# EAGLE design mother_card_10 (EAGLE 8.3.2)
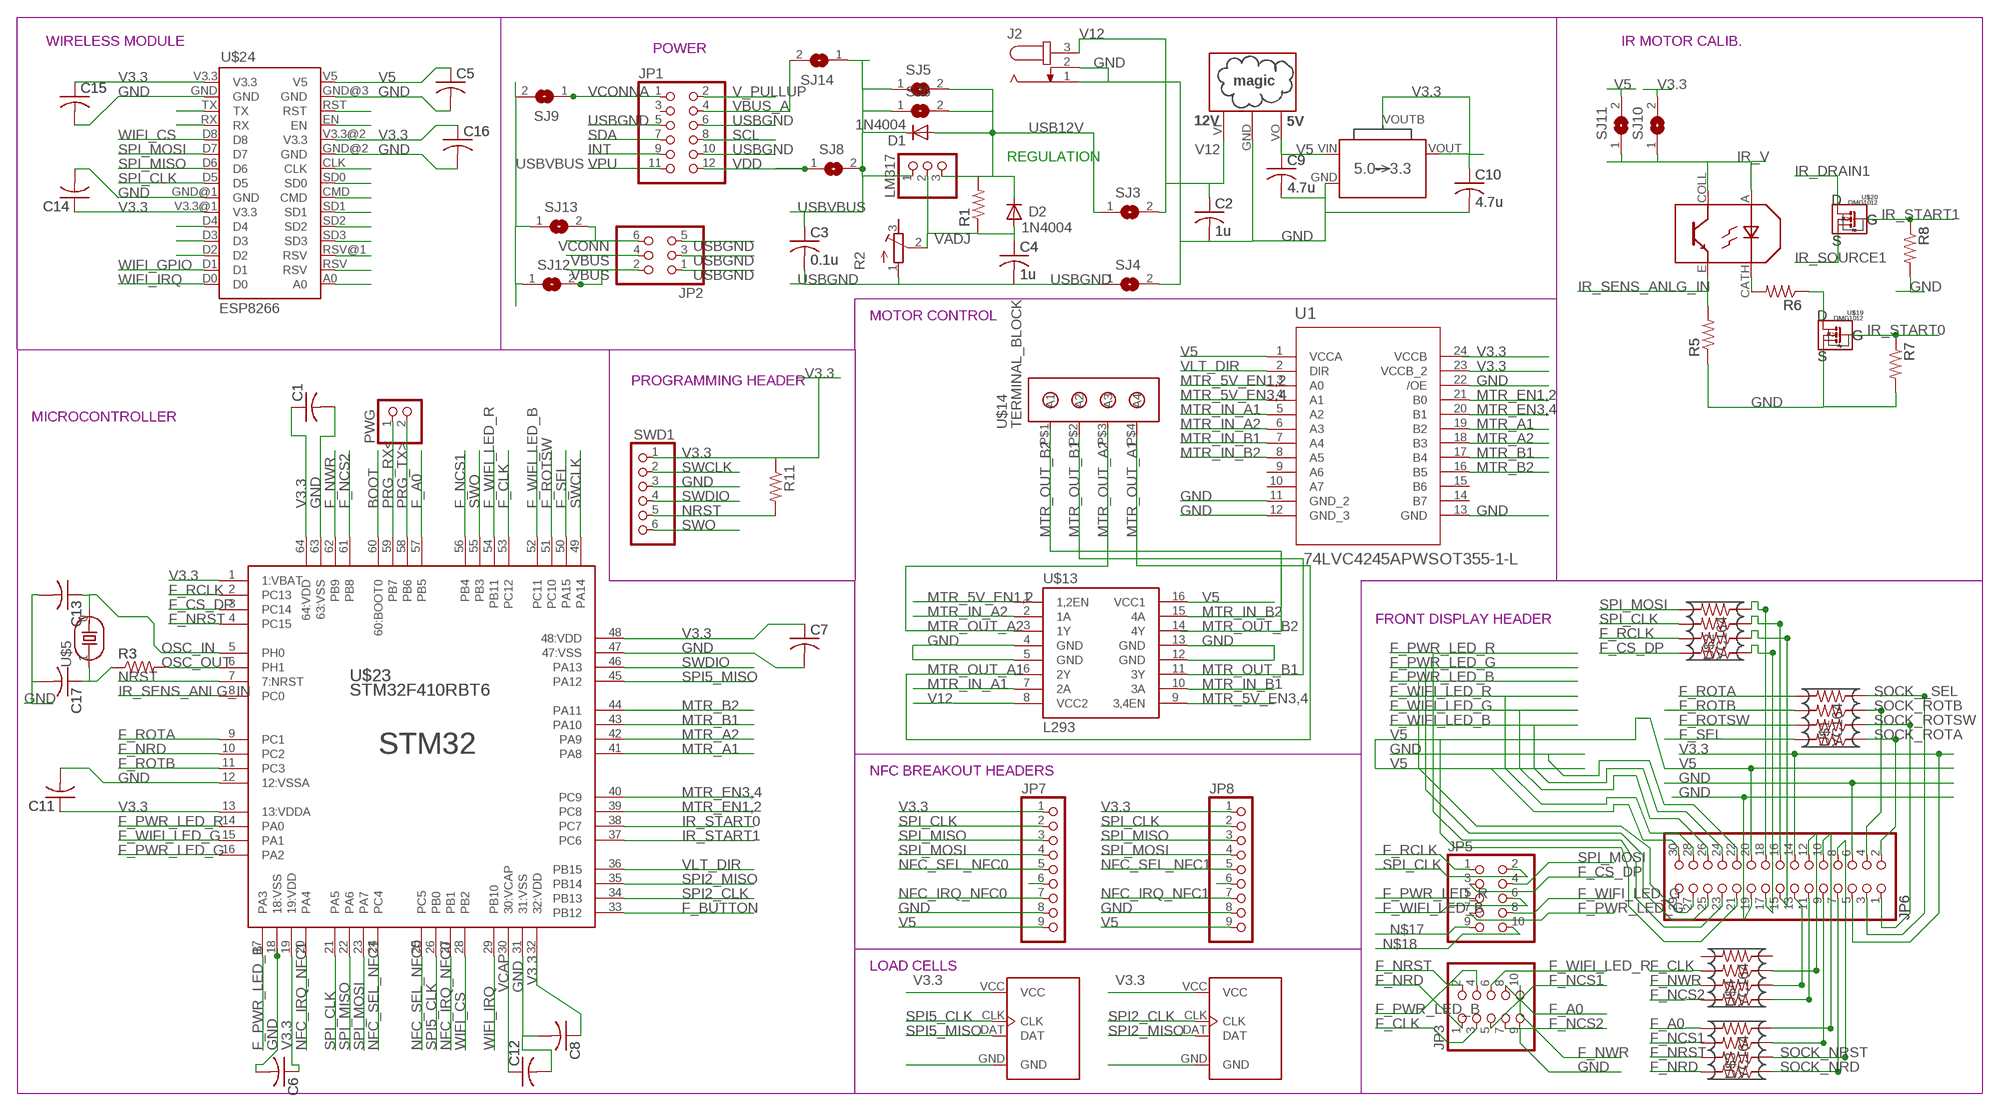
[diagram p0: schematic, sheet 1]

## Parts
C1  C-USC0805  [C0805]
C2  1u  C-USC0805  [C0805]
C3  0.1u  C-USC0805  [C0805]
C4  1u  C-USC0805  [C0805]
C5  C-USC0805  [C0805]
C6  C-USC0805  [C0805]
C7  C-USC0805  [C0805]
C8  C-USC0805  [C0805]
C9  4.7u  C-USC0805  [C0805]
C10  4.7u  C-USC0805  [C0805]
C11  C-USC0805  [C0805]
C12  C-USC0805  [C0805]
C13  C-USC0603  [C0603]
C14  C-USC0805  [C0805]
C15  C-USC0805  [C0805]
C16  C-USC0805  [C0805]
C17  C-USC0603  [C0603]
D1  1N4004  [DO41-10]
D2  1N4004  [DO41-10]
J2  JACK-PLUG0  [SPC4077]
JP1  PINHD-2X6  [2X06]
JP2  PINHD-2X3  [2X03]
JP3  PINHD-2X5  [2X05]
JP5  PINHD-2X5  [2X05]
JP6  PINHD-2X15/SOCK  [2X15/SOCK]
JP7  PINHD-1X9/90  [1X09/90]
JP8  PINHD-1X9/90  [1X09/90]
LM317  PINHD-1X3  [1X03]
PWG  PINHD-1X2  [1X02]
R1  R-US_R0805  [R0805]
R2  R-TRIMM64W  [RTRIM64W]
R3  R-US_R0805  [R0805]
R5  R-US_R0805  [R0805]
R6  R-US_R0805  [R0805]
R7  R-US_R0805  [R0805]
R8  R-US_R0805  [R0805]
R11  R-US_R0805  [R0805]
SJ3  SJ  [SJ]
SJ4  SJ  [SJ]
SJ5  SJ  [SJ]
SJ6  SJ  [SJ]
SJ8  SJ  [SJ]
SJ9  SJ  [SJ]
SJ10  SJ  [SJ]
SJ11  SJ  [SJ]
SJ12  SJ  [SJ]
SJ13  SJ  [SJ]
SJ14  SJ  [SJ]
SWD1  PINHD-1X6  [1X06]
U1  74LVC4245APWSOT355-1-L  [SOT355-1-L]
U$1  YC164  [YC164]
U$2  YC164  [YC164]
U$3  YC164  [YC164]
U$4  YC164  [YC164]
U$5  HC-49S_9B  [HC-49S_9B]
U$13  L293  [DIL16]
U$14  TERMINAL_BLOCK  [1X4/BLOCK]
U$15  AP2114H  [AP2114H]
U$16  OKI-78SR-W36  [SIP3]
U$18  TCRT5000  [TCRT5000]
U$19  DMG1012  [SOT323]
U$20  DMG1012  [SOT323]
U$21  HX711  [HX711]
U$22  HX711  [HX711]
U$23  STM32F410RBT6  [QFP50P1200X1200X160-64N]
U$24  ESP8266  [ESP8266]

## Nets
BOOT: U$23.60(60:BOOT0)
F_A0: JP3.8 U$3.P$4 U$23.57(PB5)
F_BUTTON: U$23.33(PB12)
F_CLK: JP3.3 U$4.P$3 U$23.53(PC12)
F_CS_DP: JP5.3 U$2.P$1 U$23.3(PC14)
F_NCS1: JP3.5 U$3.P$3 U$23.56(PB4)
F_NCS2: JP3.7 U$23.61(PB8)
F_NRD: JP3.1 U$3.P$1 U$23.10(PC2)
F_NRST: JP3.2 U$3.P$2 U$23.4(PC15)
F_NWR: JP3.10 U$4.P$2 U$23.62(PB9)
F_PWR_LED_B: JP3.4 JP6.27 U$23.17(PA3)
F_PWR_LED_G: JP5.7 JP6.25 U$23.16(PA2)
F_PWR_LED_R: JP5.5 JP6.23 U$23.14(PA0)
F_RCLK: JP5.1 U$2.P$2 U$23.2(PC13)
F_ROTA: U$1.P$4 U$23.9(PC1)
F_ROTB: U$1.P$3 U$23.11(PC3)
F_ROTSW: U$1.P$2 U$23.51(PC10)
F_SEL: U$1.P$1 U$23.50(PA15)
F_WIFI_LED_B: JP5.6 JP6.24 U$23.52(PC11)
F_WIFI_LED_G: JP5.8 JP6.26 U$23.15(PA1)
F_WIFI_LED_R: JP3.6 JP6.28 U$23.54(PB11)
GND: C1.2 C2.2 C5.2 C6.2 C7.2 C8.2 C9.2 C10.2 C11.2 C12.2 C13.2 C14.2 C15.2 C16.2 C17.2 J2.1 J2.2 JP3.9 JP6.6 JP6.19 JP6.22 JP7.8 JP8.8 R5.1 R7.2 R8.2 SJ4.2 SWD1.3 U1.11(GND_2) U1.12(GND_3) U1.13(GND) U1.22(/OE) U$13.4(GND) U$13.5(GND) U$13.12(GND) U$13.13(GND) U$15.GND U$16.GND U$19.S U$21.GND U$22.GND U$23.12(12:VSSA) U$23.18(18:VSS) U$23.31(31:VSS) U$23.47(47:VSS) U$23.63(63:VSS) U$24.GND U$24.GND@1(GND) U$24.GND@2(GND) U$24.GND@3(GND)
INT: JP1.9
IR_DRAIN1: U$20.D
IR_SENS_ANLG_IN: R5.2 U$18.E U$23.8(PC0)
IR_SOURCE1: U$20.S
IR_START0: R7.1 U$19.G U$23.38(PC7)
IR_START1: R8.1 U$20.G U$23.37(PC6)
IR_V: SJ10.1 SJ11.1 U$18.A U$18.COLL
MTR_5V_EN1,2: U1.3(A0) U$13.1(1,2EN)
MTR_5V_EN3,4: U1.4(A1) U$13.9(3,4EN)
MTR_A1: U1.19(B2) U$23.41(PA8)
MTR_A2: U1.18(B3) U$23.42(PA9)
MTR_B1: U1.17(B4) U$23.43(PA10)
MTR_B2: U1.16(B5) U$23.44(PA11)
MTR_EN1,2: U1.21(B0) U$23.39(PC8)
MTR_EN3,4: U1.20(B1) U$23.40(PC9)
MTR_IN_A1: U1.5(A2) U$13.7(2A)
MTR_IN_A2: U1.6(A3) U$13.2(1A)
MTR_IN_B1: U1.7(A4) U$13.10(3A)
MTR_IN_B2: U1.8(A5) U$13.15(4A)
MTR_OUT_A1: U$13.6(2Y) U$14.P$4(A4)
MTR_OUT_A2: U$13.3(1Y) U$14.P$3(A3)
MTR_OUT_B1: U$13.11(3Y) U$14.P$2(A2)
MTR_OUT_B2: U$13.14(4Y) U$14.P$1(A1)
N$1: U$24.A0
N$2: JP7.6
N$4: JP8.6
N$5: R6.2 U$18.CATH
N$8: R3.2 U$23.6(PH1)
N$9: U$24.RSV
N$10: R6.1 U$19.D
N$13: U$24.RSV@1(RSV)
N$14: U$24.SD3
N$15: U$24.SD2
N$16: U$24.SD1
N$17: JP5.9
N$18: JP5.10
N$23: U$24.CMD
N$24: U$24.SD0
N$25: U$24.CLK
N$26: U$24.D2
N$27: U$24.D3
N$28: U$24.D4
N$29: U$24.RX
N$30: U$24.TX
N$31: U$24.EN
N$32: U$24.RST
N$33: U$4.P$1
NFC_IRQ_NFC0: JP7.7 U$23.27(PB1)
NFC_IRQ_NFC1: JP8.7 U$23.20(PA4)
NFC_SEL_NFC0: JP7.5 U$23.25(PC5)
NFC_SEL_NFC1: JP8.5 U$23.24(PC4)
NRST: R11.2 SWD1.5 U$23.7(7:NRST)
OSC_IN: C13.1 U$5.0 U$23.5(PH0)
OSC_OUT: C17.1 R3.1 U$5.1
PRG_RX<: PWG.1 U$23.59(PB7)
PRG_TX>: PWG.2 U$23.58(PB6)
SCL: JP1.8
SDA: JP1.7
SOCK__CS_DP: JP6.17 U$2.P$11
SOCK__RCLK: JP6.15 U$2.P$22
SOCK__SEL: JP6.3 U$1.P$44
SOCK_A0: JP6.10 U$3.P$44
SOCK_CLK: JP6.12 U$4.P$33
SOCK_NCS1: JP6.9 U$3.P$33
SOCK_NCS2: JP6.11 U$4.P$11
SOCK_NRD: JP6.7 U$3.P$11
SOCK_NRST: JP6.8 U$3.P$22
SOCK_NWR: JP6.13 U$4.P$22
SOCK_ROTA: JP6.2 U$1.P$11
SOCK_ROTB: JP6.4 U$1.P$33
SOCK_ROTSW: JP6.1 U$1.P$22
SOCK_SPI_CLK: JP6.16 U$2.P$33
SOCK_SPI_MOSI: JP6.18 U$2.P$44
SPI2_CLK: U$22.CLK U$23.34(PB13)
SPI2_MISO: U$22.DAT U$23.35(PB14)
SPI5_CLK: U$21.CLK U$23.26(PB0)
SPI5_MISO: U$21.DAT U$23.45(PA12)
SPI_CLK: JP5.2 JP7.2 JP8.2 U$2.P$3 U$23.21(PA5) U$24.D5
SPI_MISO: JP7.3 JP8.3 U$23.22(PA6) U$24.D6
SPI_MOSI: JP5.4 JP7.4 JP8.4 U$2.P$4 U$23.23(PA7) U$24.D7
SWCLK: SWD1.2 U$23.49(PA14)
SWDIO: SWD1.4 U$23.46(PA13)
SWO: SWD1.6 U$23.55(PB3)
USB12V: D1.A D2.C LM317.3 R1.2 SJ3.1 SJ5.2 SJ6.2
USBGND: C3.2 C4.2 JP1.5 JP1.6 JP1.10 JP2.1 JP2.3 JP2.5 R2.1(A) SJ4.1
USBVBUS: C3.1 D1.C LM317.1 SJ5.1 SJ6.1 SJ8.2 SJ9.2 SJ12.1 SJ13.1 SJ14.1
V3.3: C1.1 C6.1 C7.1 C8.1 C10.1 C11.1 C14.1 C15.1 C16.1 JP6.5 JP6.14 JP7.1 JP8.1 R11.1 SJ10.2 SWD1.1 U1.23(VCCB_2) U1.24(VCCB) U$15.VOUT(VO) U$15.VOUTB(BODY) U$21.VCC U$22.VCC U$23.1(1:VBAT) U$23.13(13:VDDA) U$23.19(19:VDD) U$23.32(32:VDD) U$23.48(48:VDD) U$23.64(64:VDD) U$24.V3.3 U$24.V3.3@1(V3.3) U$24.V3.3@2(V3.3)
V5: C5.1 C9.1 JP6.20 JP6.21 JP6.30 JP7.9 JP8.9 SJ11.2 U1.1(VCCA) U$13.16(VCC1) U$15.VIN(VI) U$16.VO U$24.V5
V12: C2.1 J2.3 SJ3.2 U$13.8(VCC2) U$16.VI
V_PULLUP: JP1.2
VADJ: C4.1 D2.A LM317.2 R1.1 R2.2(S)
VBUS: JP2.2 JP2.4 SJ12.2
VBUS_A: JP1.4 SJ14.2
VCAP: C12.1 U$23.30(30:VCAP)
VCONN: JP2.6 SJ13.2
VCONNA: JP1.1 SJ9.1
VDD: JP1.12 SJ8.1
VLT_DIR: U1.2(DIR) U$23.36(PB15)
VPU: JP1.11
WIFI_CS: U$23.28(PB2) U$24.D8
WIFI_GPIO: U$24.D1
WIFI_IRQ: U$23.29(PB10) U$24.D0
Unconnected: JP1.3 JP6.29 R2.3(E) U1.9(A6) U1.10(A7) U1.14(B7) U1.15(B6) U$4.P$4 U$4.P$44

## Notes on the sheet
- WIRELESS MODULE | IR MOTOR CALIB.
- POWER
- REGULATION
- MOTOR CONTROL
- PROGRAMMING HEADER
- MICROCONTROLLER
- FRONT DISPLAY HEADER
- NFC BREAKOUT HEADERS
- LOAD CELLS

## Library data of the parts
C1-C17 = seniorDesign:C-US: CAPACITOR, American symbol
D1 D2 = diode:1N4004: DIODE general purpose rectifier, 1 A
J2 = con-jack:JACK-PLUG: DC POWER JACK Power Jack, DC, Right Angle, Through Hole, Rated 5A at 16VDC, PC Terminals Distributor: Farnell (www.Farnell.de) Drawing: 84N1161.pdf / 84N1162.pdf Manufacturer: SPC Technology (www.spctechnology.com) Type: SPC4077 / SPC 4078; OC_FARNELL: unknown; OC_NEWARK: unknown
JP1 = pinhead:PINHD-2X6: PIN HEADER
JP2 = pinhead:PINHD-2X3: PIN HEADER
JP3 JP5 = pinhead:PINHD-2X5: PIN HEADER
JP6 = seniorDesign:PINHD-2X15: PIN HEADER, socket for parallel cable, IDC connector, On Shore Technology Inc.
JP7 JP8 = pinhead:PINHD-1X9: PIN HEADER
LM317 = pinhead:PINHD-1X3: PIN HEADER
PWG = pinhead:PINHD-1X2: PIN HEADER
R1 R3 R5-R8 = seniorDesign:R-US_: RESISTOR, American symbol
R2 = rcl:R-TRIMM: Trimm resistor
R11 = resistor:R-US_: RESISTOR, American symbol
SJ3-SJ6 SJ8-SJ14 = jumper:SJ: SMD solder JUMPER
SWD1 = pinhead:PINHD-1X6: PIN HEADER
U1 = seniorDesign:74LVC4245APW: Level Translator input board; MANUFACTURER_PART_NUMBER: 74LVC4245APW; VENDOR: NXP
U$1-U$4 = seniorDesign:YC164: Yageo Resistor Array motherboard serial resistance for cables headed offboard
U$5 = seniorDesign:HC-49S_9B: TXC CORPORATION 9B-25.000MBBK-B motherboard stm32 HSE external clock reference http://www.txccorp.com/download/products/quartz_crystals/2015TXC_9B_33.pdf
U$13 = seniorDesign:L293: L293 Stepper Motor Driver
U$14 = seniorDesign:TERMINAL_BLOCK: Terminal Block for stepper motor connections
U$15 = seniorDesign:AP2114: AP2114H-3.3TRG1DICT-ND 5V LDO, main 5V line, motherboard https://www.diodes.com/assets/Datasheets/AP2114.pdf
U$16 = seniorDesign:OKI-78SR-W36
U$18 = seniorDesign:TCRT5000: Vishay Semiconductor Opto Division TCRT5000 mother board cover repositioning http://www.vishay.com/docs/83760/tcrt5000.pdf
U$19 U$20 = seniorDesign:DMG1012: DMG1012UW-7DICT-ND https://www.diodes.com/assets/Datasheets/ds31859.pdf Vt ~= 1.25V, IDS ~= 0.900 A, [VGS = (3.3 - 0.7)V, VDS = 0V]
U$21 U$22 = seniorDesign:HX711: old green circuit board rendition of HX711 load amplifier
U$23 = seniorDesign:STM32F410RBT6: STMicroelectronics STM32F410RBT6 main microcontroller, motherboard http://www.st.com/.../content/translations/en.DM00214043.pdf <http://www.st.com/content/ccc/resource/technical/document/datasheet/6e/f3/b0/1b/05/eb/49/fe/DM00214043.pdf/files/DM00214043.pdf/jcr:content/translations/en.DM00214043.pdf>
U$24 = seniorDesign:ESP8266: ESP8266 Wifi Module Breakout

## Board
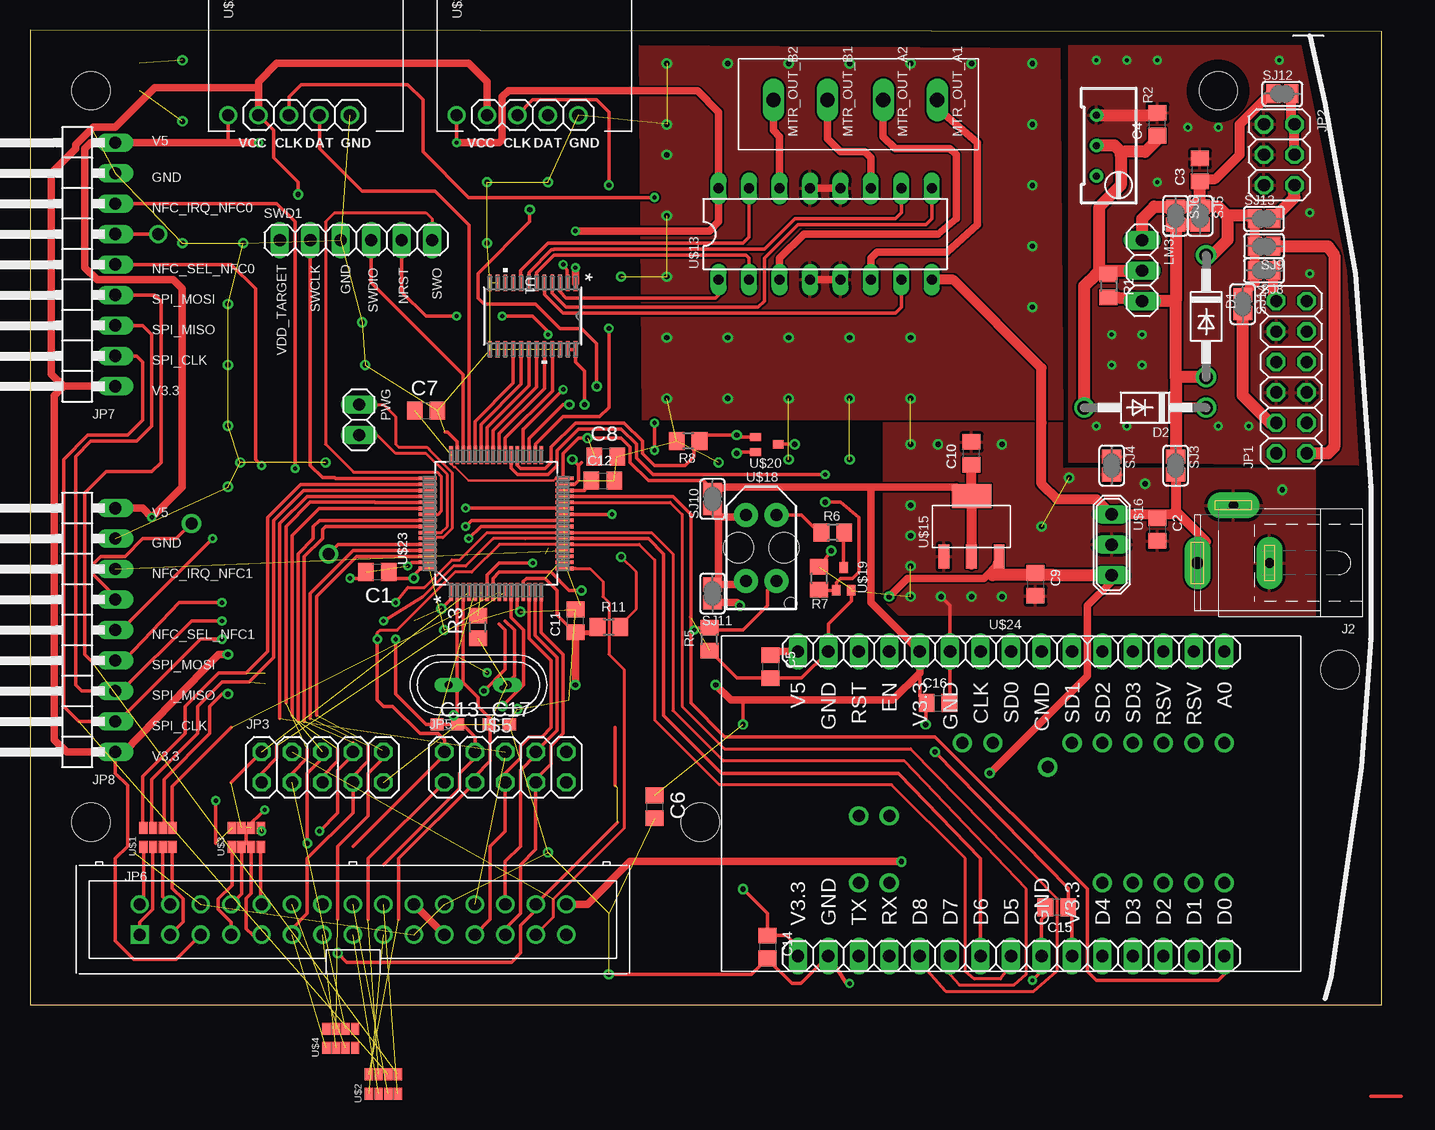
[diagram p1: board, top side]
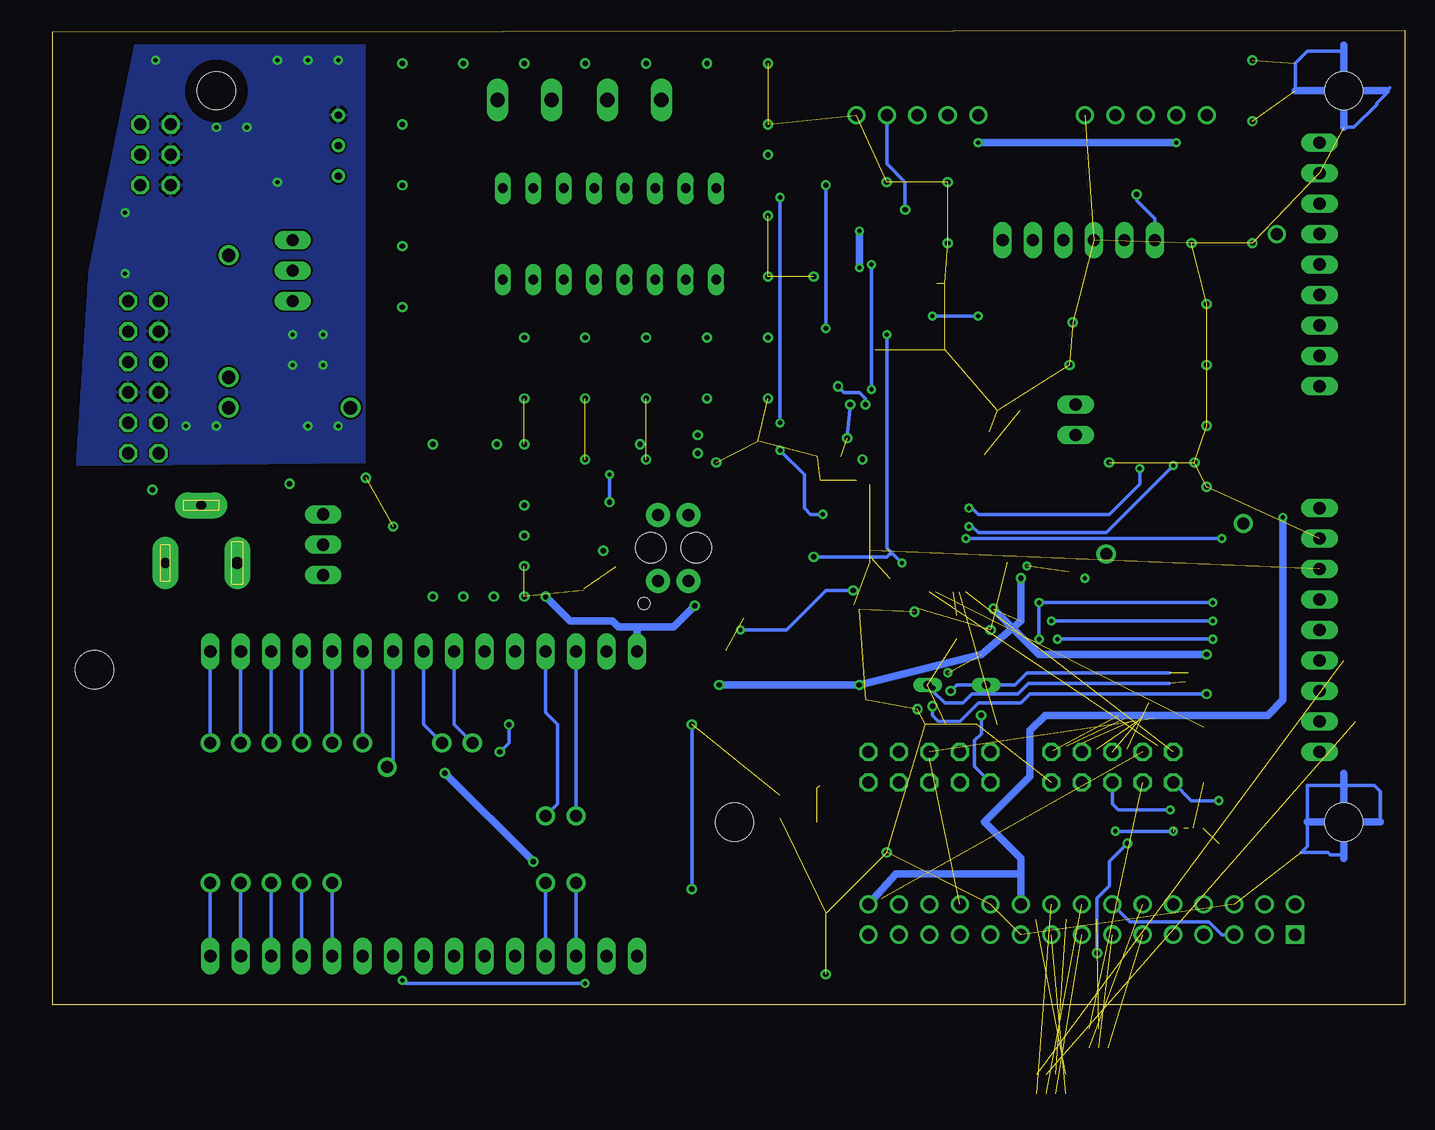
[diagram p2: board, bottom side, seen from below]

Size 112.7 x 81.27 mm. Coordinates in mm from the lower left corner, seen from the top.
Outline: 0,0 112.7,0 112.7,81.14 0,81.27 0,0
Copper layers (1*16): Top 0.035mm / dielectric 1.5mm / Bottom 0.035mm
Design rules "default": minimum track width 6mil, minimum drill 0.35mm, track to track 6mil, track to pad 6mil, pad to pad 6mil, via to via 6mil, smd to smd 6mil, copper to edge 40mil, drill to drill 6mil, minimum pad ring 10mil, minimum via ring 8mil, stop-mask expansion 4mil, vias tented up to drill 0mil, thermal gap 10mil
Holes 3.17 mm at 5.08,76.2 5.08,15.24 109.22,27.94 99.06,76.2 55.88,15.24

### Footprints (pad centres in the part's own frame; a part is rotated, then mirrored left to right if it is on the bottom)
C0805 = smd 1.3 x 1.5: 1 -0.95,0; 2 0.95,0
C0603 = smd 1.1 x 1: 1 -0.85,0; 2 0.85,0
DO41-10 = drill 1.118: A 5.08,0; C -5.08,0
SPC4077 = drill 0.8 pad 2.184 long: 1 -3,0; 2 0,-4.8 | drill 1 pad 2.184 long: 3 3,0
2X06 = drill 1.016 octagon: 1 -6.35,-1.27; 2 -6.35,1.27; 3 -3.81,-1.27; 4 -3.81,1.27; 5 -1.27,-1.27; 6 -1.27,1.27; 7 1.27,-1.27; 8 1.27,1.27; 9 3.81,-1.27; 10 3.81,1.27; 11 6.35,-1.27; 12 6.35,1.27
2X03 = drill 1.016 octagon: 1 -2.54,-1.27; 2 -2.54,1.27; 3 0,-1.27; 4 0,1.27; 5 2.54,-1.27; 6 2.54,1.27
2X05 = drill 1.016 octagon: 1 -5.08,-1.27; 2 -5.08,1.27; 3 -2.54,-1.27; 4 -2.54,1.27; 5 0,-1.27; 6 0,1.27; 7 2.54,-1.27; 8 2.54,1.27; 9 5.08,-1.27; 10 5.08,1.27
2X15/SOCK = drill 1.016 square: 1 -17.78,-1.27 | drill 1.016: 2 -17.78,1.27; 3 -15.24,-1.27; 4 -15.24,1.27; 5 -12.7,-1.27; 6 -12.7,1.27; 7 -10.16,-1.27; 8 -10.16,1.27; 9 -7.62,-1.27; 10 -7.62,1.27; 11 -5.08,-1.27; 12 -5.08,1.27; 13 -2.54,-1.27; 14 -2.54,1.27; 15 0,-1.27; 16 0,1.27; 17 2.54,-1.27; 18 2.54,1.27; 19 5.08,-1.27; 20 5.08,1.27; 21 7.62,-1.27; 22 7.62,1.27; 23 10.16,-1.27; 24 10.16,1.27; 25 12.7,-1.27; 26 12.7,1.27; 27 15.24,-1.27; 28 15.24,1.27; 29 17.78,-1.27; 30 17.78,1.27
1X09/90 = drill 1.016 long: 1 -10.16,-3.81; 2 -7.62,-3.81; 3 -5.08,-3.81; 4 -2.54,-3.81; 5 0,-3.81; 6 2.54,-3.81; 7 5.08,-3.81; 8 7.62,-3.81; 9 10.16,-3.81
1X03 = drill 1.016 long: 1 -2.54,0; 2 0,0; 3 2.54,0
1X02 = drill 1.016 long: 1 -1.27,0; 2 1.27,0
R0805 = smd 1.3 x 1.5: 1 -0.95,0; 2 0.95,0
RTRIM64W = drill 0.61: 1 1.27,-2.54; 2 1.27,0; 3 1.27,2.54
SJ = smd 1.168 x 1.6: 1 -0.762,0; 2 0.762,0
1X06 = drill 1.016 long: 1 -6.35,0; 2 -3.81,0; 3 -1.27,0; 4 1.27,0; 5 3.81,0; 6 6.35,0
SOT355-1-L = smd 1.372 x 0.305: 1 -2.769,3.575; 2 -2.769,2.925; 3 -2.769,2.275; 4 -2.769,1.625; 5 -2.769,0.975; 6 -2.769,0.325; 7 -2.769,-0.325; 8 -2.769,-0.975; 9 -2.769,-1.625; 10 -2.769,-2.275; 11 -2.769,-2.925; 12 -2.769,-3.575; 13 2.769,-3.575; 14 2.769,-2.925; 15 2.769,-2.275; 16 2.769,-1.625; 17 2.769,-0.975; 18 2.769,-0.325; 19 2.769,0.325; 20 2.769,0.975; 21 2.769,1.625; 22 2.769,2.275; 23 2.769,2.925; 24 2.769,3.575
YC164 = smd 0.7 x 1: P$1 -1.2,0.8; P$2 -0.4,0.8; P$3 0.4,0.8; P$4 1.2,0.8; P$11 -1.2,-0.8; P$22 -0.4,-0.8; P$33 0.4,-0.8; P$44 1.2,-0.8
HC-49S_9B = drill 0.7 long: 0 -2.44,0; 1 2.44,0
DIL16 = drill 0.813 long: 1 -8.89,-3.81; 2 -6.35,-3.81; 3 -3.81,-3.81; 4 -1.27,-3.81; 5 1.27,-3.81; 6 3.81,-3.81; 7 6.35,-3.81; 8 8.89,-3.81; 9 8.89,3.81; 10 6.35,3.81; 11 3.81,3.81; 12 1.27,3.81; 13 -1.27,3.81; 14 -3.81,3.81; 15 -6.35,3.81; 16 -8.89,3.81
1X4/BLOCK = drill 1.2 long: P$1 0,0; P$2 4.5,0; P$3 9.15,0; P$4 13.65,0
AP2114H = smd 0.9 x 2: GND -2.3,-2.52; VIN 2.3,-2.52; VOUT 0,-2.52 | smd 3.3 x 2: VOUTB 0,2.53
SIP3 = drill 1.016 long: GND 0,0; VI -2.54,0; VO 2.54,0
TCRT5000 = drill 1 pad 2: A 2.75,1.27; CATH 2.75,-1.27; COLL -2.75,1.27; E -2.75,-1.27 | hole 2.5: 0,1.9; 0,-1.9 | hole 1: -4.65,-2.45
SOT323 = smd 0.7 x 0.9: D 0,0.9; G -0.6,-1; S 0.65,-1
HX711 = drill 1.016: CLK -2.54,1.52; DAT -2.54,4.06; GND -2.54,6.6; VCC -2.54,-1.02
QFP50P1200X1200X160-64N = smd 1.5 x 0.3: 1 -5.715,3.759; 2 -5.715,3.251; 3 -5.715,2.743; 4 -5.715,2.261; 5 -5.715,1.753; 6 -5.715,1.245; 7 -5.715,0.762; 8 -5.715,0.254; 9 -5.715,-0.254; 10 -5.715,-0.762; 11 -5.715,-1.245; 12 -5.715,-1.753; 13 -5.715,-2.261; 14 -5.715,-2.743; 15 -5.715,-3.251; 16 -5.715,-3.759; 33 5.715,-3.759; 34 5.715,-3.251; 35 5.715,-2.743; 36 5.715,-2.261; 37 5.715,-1.753; 38 5.715,-1.245; 39 5.715,-0.762; 40 5.715,-0.254; 41 5.715,0.254; 42 5.715,0.762; 43 5.715,1.245; 44 5.715,1.753; 45 5.715,2.261; 46 5.715,2.743; 47 5.715,3.251; 48 5.715,3.759 | smd 0.3 x 1.5: 17 -3.759,-5.715; 18 -3.251,-5.715; 19 -2.743,-5.715; 20 -2.261,-5.715; 21 -1.753,-5.715; 22 -1.245,-5.715; 23 -0.762,-5.715; 24 -0.254,-5.715; 25 0.254,-5.715; 26 0.762,-5.715; 27 1.245,-5.715; 28 1.753,-5.715; 29 2.261,-5.715; 30 2.743,-5.715; 31 3.251,-5.715; 32 3.759,-5.715; 49 3.759,5.715; 50 3.251,5.715; 51 2.743,5.715; 52 2.261,5.715; 53 1.753,5.715; 54 1.245,5.715; 55 0.762,5.715; 56 0.254,5.715; 57 -0.254,5.715; 58 -0.762,5.715; 59 -1.245,5.715; 60 -1.753,5.715; 61 -2.261,5.715; 62 -2.743,5.715; 63 -3.251,5.715; 64 -3.759,5.715
ESP8266 = drill 1.016 long: A0 19.05,0; CLK -1.27,0; CMD 3.81,0; D0 19.05,-25.4; D1 16.51,-25.4; D2 13.97,-25.4; D3 11.43,-25.4; D4 8.89,-25.4; D5 1.27,-25.4; D6 -1.27,-25.4; D7 -3.81,-25.4; D8 -6.35,-25.4; EN -8.89,0; GND -13.97,-25.4; GND@1 3.81,-25.4; GND@2 -3.81,0; GND@3 -13.97,0; RST -11.43,0; RSV 16.51,0; RSV@1 13.97,0; RX -8.89,-25.4; SD0 1.27,0; SD1 6.35,0; SD2 8.89,0; SD3 11.43,0; TX -11.43,-25.4; V3.3 -16.51,-25.4; V3.3@1 6.35,-25.4; V3.3@2 -6.35,0; V5 -16.51,0

### Placement (x,y rotation side)
C1  28.96,36.07 180 top
C2  93.98,39.62 270 top
C3  97.54,69.6 90 top
C4  93.98,73.41 90 top
C5  61.72,28.19 270 top
C6  52.07,16.51 270 top
C7  33.02,49.53 0 top
C8  48.01,45.72 0 top
C9  83.82,35.05 270 top
C10  78.49,45.97 90 top
C11  45.47,32 90 top
C12  47.75,43.69 0 top
C13  34.8,23.37 0 top
C14  61.47,4.83 270 top
C15  85.6,8.13 180 top
C16  75.69,25.15 0 top
C17  39.12,23.37 0 top
D1  98.04,57.4 270 top
D2  92.96,49.78 180 top
J2  100.33,36.83 180 top
JP1  105.16,52.32 90 top
JP2  104.14,70.87 270 top
JP3  24.38,19.81 0 top
JP5  39.62,19.81 0 top
JP6  26.92,7.11 0 top
JP7  3.3,61.72 90 top
JP8  3.3,31.24 90 top
LM317  92.71,61.21 270 top
PWG  27.43,48.77 270 top
R1  89.92,59.94 270 top
R2  90.17,71.63 180 top
R3  37.34,31.5 90 top
R5  56.64,30.48 90 top
R6  66.93,39.37 180 top
R7  65.79,35.56 90 top
R8  54.86,46.99 180 top
R11  48.26,31.5 0 top
SJ3  95.5,44.96 270 top
SJ4  90.17,44.96 270 top
SJ5  97.54,65.79 270 top
SJ6  95.5,65.79 270 top
SJ8  102.87,61.21 180 top
SJ9  102.87,63.25 180 top
SJ10  56.9,42.16 90 top
SJ11  56.9,34.29 270 top
SJ12  104.39,75.95 0 top
SJ13  102.87,65.53 0 top
SJ14  101.09,58.42 270 top
SWD1  27.18,63.75 0 top
U1  41.91,57.4 270 top
U$1  10.67,13.97 0 top
U$2  29.46,-6.6 0 top  (outside the outline)
U$3  18.03,13.97 0 top
U$4  25.91,-2.79 0 top
U$5  37.34,26.67 0 top
U$13  66.29,64.26 0 top
U$14  61.98,75.44 0 top
U$15  78.49,39.88 0 top
U$16  90.17,38.35 270 top
U$18  60.96,38.1 90 top
U$19  67.82,35.56 0 top
U$20  61.47,46.74 270 top
U$21  20.07,71.63 270 top
U$22  39.12,71.63 270 top
U$23  38.86,40.13 90 top
U$24  80.52,29.46 0 top

### Tracks (layer width: path | path; a pad name or v marks a point on that pad's centre or on a via)
BOOT  (via drill 1 pad 1.6)
  Top 0.305: U$23.60 25.68,38.38 v24.89,37.59
F_A0  (via drill 0.35)  (2 unrouted)
  Top 0.305: v24.13,14.48 25.65,16 25.65,19.56 26.92,20.83 JP3.8 26.92,21.84 | U$23.57 24.64,39.88 24.38,39.62 24.38,38.88 22.86,37.36 22.86,23.62
  Bottom 0.305: v24.13,14.48 v19.3,14.48
F_CLK  (2 unrouted)
  Top 0.305: U$23.53 28.76,41.89 28.73,41.91 23.37,41.91 21.34,39.88 21.34,25.15 | 23.11,21.34 23.11,20.57 21.84,19.3 JP3.3
F_CS_DP  (1 unrouted)
  Top 0.305: 30.73,7.11 30.73,12.19 JP5.3 37.08,19.05 38.35,20.32 38.35,23.88 37.34,24.89 37.34,25.63 37.11,25.86 37.11,25.88 36.12,26.87 U$23.3
F_NCS1  (via drill 0.35)  (2 unrouted)
  Top 0.305: 18.03,13.46 18.03,14.73 v19.56,16.26 | U$23.56 24.13,40.39 23.62,39.88 23.62,38.86 22.35,37.59 22.35,23.62 | 25.65,21.34 25.65,20.32 24.38,19.05 JP3.5
  Bottom 0.305: JP3.5 24.38,16.76 23.88,16.26 v19.56,16.26
F_NCS2  (1 unrouted)
  Top 0.305: U$23.61 26.95,37.87 23.37,34.29 23.37,23.88 | 28.19,21.59 28.19,20.32 26.92,19.05 JP3.7 26.92,16 23.11,12.19 23.11,7.62 21.84,6.35
F_NRD  (via drill 0.35)  (2 unrouted)
  Top 0.305: 20.57,21.59 20.57,20.57 19.3,19.3 JP3.1 | v15.49,17.02 15.49,13.46
  Bottom 0.305: JP3.1 17.78,17.02 v15.49,17.02
F_NRST  (2 unrouted)
  Top 0.305: JP3.2 16.76,18.54
F_NWR  (2 unrouted)
  Top 0.305: U$23.62 27.23,37.39 23.88,34.04 23.88,24.13 | JP3.10 29.34,21.21 29.34,20.45 28.19,19.3 28.19,15.75 25.65,13.21 25.65,7.11
F_PWR_LED_B  (1 unrouted)
  Top 0.254: JP6.27 43.64,7.32 43.64,8.82 49.53,14.72 49.53,27.94 48.26,29.21 48.26,33.53 47.75,34.04 47.75,35.31 46.69,36.37 45.47,36.37
  Top 0.305: JP3.4 21.84,21.34 | U$23.17 45.47,36.37
F_PWR_LED_G
  Top 0.305: JP6.25 39.62,6.35 40.89,7.62 40.89,11.68 42.16,12.95 JP5.7 42.16,18.8 43.43,20.07 43.43,21.59 44.45,22.61 44.45,29.21 42.62,31.04 U$23.16
F_PWR_LED_R
  Top 0.305: U$23.14 41.61,30.53 43.43,28.7 43.43,23.11 42.67,22.35 41.66,22.35 40.89,21.59 40.89,20.57 39.62,19.3 JP5.5 39.62,14.48 38.35,13.21 38.35,7.11 JP6.23
F_RCLK  (via drill 0.45)  (1 unrouted)
  Top 0.305: 28.19,7.11 28.19,12.19 JP5.1 | v35.31,24.13 35.61,24.43 U$23.2
  Bottom 0.305: v35.31,24.13 35.31,22.59 35.86,22.03 35.86,19.86 JP5.1
F_ROTA  (1 unrouted)
  Top 0.305: U$1.P$4 11.87,18.22 16.76,23.11
F_ROTB  (via drill 0.45)
  Top 0.305: U$23.11 40.11,32.28 41.15,31.24 41.15,26.67 v39.37,24.89 | v16.51,25.91 16,25.91 14.99,24.89 14.99,22.61 11.18,18.8 11.18,14.88 U$1.P$3
  Bottom 0.305: v39.37,24.89 39.37,24.13 38.86,23.62 37.08,23.62 35.56,25.15 32,25.15 31.24,25.91 v16.51,25.91
F_ROTSW  (via drill 0.45)  (1 unrouted)
  Top 0.305: 39.62,32 40.39,31.24 40.39,27.43 v39.37,26.42 | U$1.P$2 10.16,14.88 10.16,18.8 13.97,22.61 13.97,24.89 16,26.92 18.29,26.92 20.32,28.96 20.32,40.39 22.81,42.88 U$23.51
  Bottom 0.305: v39.37,26.42 39.37,26.16 38.35,25.15 36.83,25.15 36.07,25.91 32.26,25.91 31.37,26.8 19.61,26.8
F_SEL  (via drill 0.45)  (1 unrouted)
  Top 0.305: 39.12,31.75 39.62,31.24 39.62,27.94 v37.85,26.16 | U$1.P$1 9.4,14.84 9.4,19.05 12.95,22.61 12.95,24.89 15.75,27.69 18.03,27.69 19.81,29.46 19.81,40.64 22.55,43.38 U$23.50
  Bottom 0.305: v37.85,26.16 37.34,26.67 32.51,26.67 31.5,27.69 19.61,27.69
F_WIFI_LED_B  (2 unrouted)
  Top 0.305: 39.62,20.57 JP5.6 | U$23.52 23.09,42.39 20.83,40.13 20.83,23.88
F_WIFI_LED_G
  Top 0.305: JP6.26 39.62,11.94 40.89,13.21 40.89,19.56 42.16,20.83 JP5.8 43.94,22.86 43.94,28.96 42.11,30.79 U$23.15
F_WIFI_LED_R  (via drill 0.4, 0.45)  (3 unrouted)
  Top 0.305: 21.84,24.13 21.84,39.12 24.11,41.38 U$23.54 | JP3.6 24.38,20.57 23.11,19.3 v23.11,13.46 | v25.65,4.32 26.42,3.56 40.13,3.56 40.89,4.32 40.89,6.6 42.16,7.87 JP6.28 48.99,15.21 | 48.77,18.31 48.77,23.11
  Bottom 0.305: v23.11,13.46 24.64,11.94 24.64,9.91 25.65,8.89 v25.65,4.32
GND  (via drill 0.35, 0.45)  (64 unrouted)
  Top 0.305: 68.47,34.69 U$19.S 68.47,33.67 66.55,31.75 U$24.GND@3 64.33,27.24 C5.2 58.93,27.24 R5.1 | 45.91,33.34 C11.2 | U$23.31 45.42,43.38 45.72,43.69 45.72,44.96 | 45.97,45.21 45.72,44.96 | 45.72,44.96 v45.21,45.47 | U$23.12 40.62,33.02 v40.87,32.77 | 55.05,32.32 55.12,32.26 | R7.2 66.61,37.59 v66.8,37.85 | C16.2 76.71,25.21 U$24.GND@2 76.71,33.27 v75.95,34.04 | v48.26,2.54 60.13,2.54 C14.2 61.47,3.81 63.5,1.78 64.26,1.78 U$24.GND 68.07,1.78 v68.33,1.78 | C15.2 84.65,7.43 84.33,7.11 U$24.GND@1 84.33,2.79 v83.57,2.03 | U$23.47 35.61,46.94 34.8,47.75 34.61,47.75 | U$23.63 31.8,36.88 v31.5,36.58 | C1.2 27.5,35.56 v26.67,35.56
  Top 0.61: U$13.4 U$13.5 | U$13.13 U$13.12
  Bottom 0.305: 5.08,12.48 5.08,12.19 5.37,12.48 6.22,12.48 6.44,12.7 8.64,12.7 8.13,13.21 8.13,15.24 8.13,18.29 2.54,18.29 2.03,17.78 2.03,15.24 | 9.14,76.2 9.14,78.49 8.13,79.5 5.08,79.5 | 1.52,75.95 2.32,75.15 2.32,75.06 4.23,73.15 5.08,73.15 | 1.52,76.2 1.27,76.45 | v83.57,2.03 83.31,1.78 v68.33,1.78
  Bottom 0.61: 8.13,15.24 v5.08,15.24 | v5.08,15.24 5.08,12.19 | v5.08,15.24 2.03,15.24 | v5.08,15.24 5.08,19.3 | 9.14,76.2 v5.08,76.2 | v5.08,76.2 5.08,80.01 | v5.08,76.2 5.08,73.15 | v5.08,76.2 1.52,76.2
  other vias: 81.03,46.74 75.69,46.74 104.39,42.93 73.41,46.74 73.41,41.66 73.41,39.12 73.41,36.58 73.41,34.04 78.49,34.04 81.03,34.04 84.33,39.88 73.41,50.55 68.33,50.55 63.25,50.55 58.17,50.55 53.09,50.55 53.09,55.63 53.09,60.71 53.09,65.79 53.09,70.87 53.09,73.41 53.09,78.49 58.17,78.49 63.25,78.49 68.33,78.49 73.41,78.49 78.49,78.49 83.57,78.49 83.57,73.41 83.57,68.33 83.57,63.25 83.57,58.17 73.41,55.63 68.33,55.63 63.25,55.63 58.17,55.63 43.18,12.7 16.51,43.18 16.51,48.26 16.51,53.34 12.7,63.5 16.51,58.42 12.7,78.74 12.7,73.66 17.78,63.5 27.94,53.34 27.69,56.9 38.1,63.5 38.1,68.58 43.18,68.58 57.4,45.21 63.25,45.47 68.33,45.47 49.28,60.71 34.52,31.24 17.53,45.21 24.64,45.21 40.62,24.64 92.96,43.43 86.61,43.94
  pour Top: 71.12,48.51 71.12,33.78 72.39,32.51 107.19,32.51 107.19,44.7 86.11,44.7 86.11,48.51
  pour Top: 50.8,80.01 85.85,79.76 86.11,48.77 51.05,48.77
IR_DRAIN1  (via drill 0.45)
  Top 0.305: U$20.D v63.75,46.74
IR_SENS_ANLG_IN  (via drill 0.35, 0.45)
  Top 0.305: U$23.8 38.61,35.56 39.12,36.07 43.43,36.07 44.96,34.54 v45.97,34.54 | U$18.E 61.47,34.59 61.47,33.27 59.44,31.24 56.83,31.24 R5.2 55.56,31.43 v55.37,31.24
  Bottom 0.305: v45.97,34.54 48.26,34.54 51.56,31.24 v55.37,31.24
IR_SOURCE1  (via drill 0.45)
  Top 0.305: U$20.S 59.04,46.09 v58.93,45.97
IR_START0  (via drill 0.35, 0.45)
  Top 0.254: U$19.G 67.27,34.56
  Top 0.305: R7.1 65.33,34.56 U$19.G 67.22,35.21 67.56,35.56 68.58,35.56 69.09,36.07 69.09,40.64 67.56,41.91 v66.29,41.91 | U$23.38 40.11,44.73 40.64,44.2 43.18,44.2 43.94,44.96 43.94,46.23 45.72,48.01 49.28,48.01 50.55,46.74 50.55,45.57 51.92,44.2 v66.29,44.2
  Bottom 0.305: v66.29,41.91 v66.29,44.2
IR_START1  (via drill 0.45)
  Top 0.305: 60.52,47.39 U$20.G 59.09,47.34 v58.93,47.5 56.32,47.5 56.1,47.28 R8.1 55.37,46.55 55.37,45.72 54.61,44.96 52.07,44.96 51.05,45.97 51.05,46.99 49.53,48.51 45.47,48.51 43.43,46.48 43.43,45.21 42.93,44.7 40.89,44.7 40.62,44.98 U$23.37
IR_V
  Top 0.61: U$18.COLL 59.39,35.05 SJ11.1 57.4,35.56 57.4,41.15 SJ10.1 57.18,40.67 59.51,40.67 U$18.A
MTR_5V_EN1,2
  Top 0.305: U1.3 44.19,59.45 44.7,58.93 57.15,58.93 57.4,59.18 U$13.1
MTR_5V_EN3,4
  Top 0.305: 43.53,60.81 U1.4 43.53,59.33 44.7,58.17 60.71,58.17 61.21,58.67 61.21,62.23 64.01,65.02 74.68,65.02 75.18,65.53 U$13.9
MTR_A1
  Top 0.305: 38.66,45.9 U$23.41 38.61,47.88 42.23,51.51 U1.19
MTR_A2
  Top 0.305: U1.18 41.59,51.62 38.1,48.13 U$23.42
MTR_B1
  Top 0.305: 37.59,45.87 U$23.43 37.59,45.87 | U1.17 40.94,51.73 37.59,48.39 37.59,45.87
MTR_B2
  Top 0.305: U1.16 40.28,51.84 37.08,48.64 37.08,45.87 U$23.44
MTR_EN1,2
  Top 0.305: U$23.39 39.62,47.24 43.56,51.18 43.56,54.61 U1.21
MTR_EN3,4
  Top 0.305: U1.20 42.89,51.39 39.12,47.62 U$23.40
MTR_IN_A1
  Top 0.305: U1.5 42.89,59.22 44.45,57.66 72.14,57.66 72.64,58.17 U$13.7
MTR_IN_A2
  Top 0.305: U1.6 42.23,61.03 43.69,62.48 59.69,62.48 59.94,62.23 U$13.2
MTR_IN_B1
  Top 0.305: U1.7 41.59,61.03 43.5,62.94 43.64,62.94 43.69,62.99 61.21,62.99 63.75,65.53 72.14,65.53 72.64,66.04 U$13.10
MTR_IN_B2
  Top 0.305: U$13.15 59.94,64.01 59.44,63.5 43.18,63.5 40.89,61.21 40.89,60.21 U1.8
MTR_OUT_A1
  Top 0.61: U$13.6 70.1,62.23 70.61,62.74 76.45,62.74 78.99,65.02 78.99,71.88 75.63,74.74 U$14.P$4
MTR_OUT_A2
  Top 0.305: 62.48,60.96 U$13.3
  Top 0.61: U$13.3 62.48,62.23 64.52,64.26 75.69,64.26 77.22,65.53 77.22,70.87 76.71,71.37 72.14,71.37 71.12,72.39 U$14.P$3
MTR_OUT_B1
  Top 0.61: U$14.P$2 66.48,72.21 67.56,71.12 69.6,71.12 70.1,70.61 U$13.11
MTR_OUT_B2
  Top 0.61: U$13.14 62.48,72.39 61.98,72.9 U$14.P$1
N$1  (via drill 1 pad 1.6)
  Bottom 0.305: U$24.A0 v99.57,21.84
N$2  (via drill 1)
  Top 0.305: JP7.6 v10.67,64.26
N$3
  Top 0.305: 111.76,-7.62 114.3,-7.62
N$4  (via drill 1 pad 1.6)
  Top 0.305: JP8.6 7.11,34.05 5.28,35.88 5.28,36.76 5.91,37.39 7.93,37.39 9.4,38.86 12.19,38.86 v13.46,40.13
N$5
  Top 0.305: U$18.CATH 64.29,40.85 65.53,39.61 65.53,39.05 R6.2
N$8  (1 unrouted)
N$9  (via drill 1 pad 1.6)
  Bottom 0.305: U$24.RSV v97.03,21.84
N$10
  Top 0.305: U$19.D 67.82,38.8 R6.1
N$13  (via drill 1 pad 1.6)
  Bottom 0.305: U$24.RSV@1 v94.49,21.84
N$14  (via drill 1 pad 1.6)
  Bottom 0.305: U$24.SD3 v91.95,21.84
N$15  (via drill 1 pad 1.6)
  Bottom 0.305: U$24.SD2 v89.41,21.84
N$16  (via drill 1 pad 1.6)
  Bottom 0.305: U$24.SD1 v86.87,21.84
N$23  (via drill 1 pad 1.6)
  Bottom 0.305: U$24.CMD 84.33,20.32 v84.84,19.81
N$24  (via drill 1 pad 1.6)
  Bottom 0.305: U$24.SD0 81.79,23.37 v80.26,21.84
N$25  (via drill 1 pad 1.6)
  Bottom 0.305: U$24.CLK 79.25,23.37 v77.72,21.84
N$26  (via drill 1 pad 1.6)
  Bottom 0.305: U$24.D2 v94.49,10.16
N$27  (via drill 1 pad 1.6)
  Bottom 0.305: U$24.D3 v91.95,10.16
N$28  (via drill 1 pad 1.6)
  Bottom 0.305: U$24.D4 v89.41,10.16
N$29  (via drill 1 pad 1.6)
  Bottom 0.305: U$24.RX v71.63,10.16
N$30  (via drill 1 pad 1.6)
  Bottom 0.305: U$24.TX v69.09,10.16
N$31  (via drill 1 pad 1.6)
  Bottom 0.305: U$24.EN 71.63,24.38 70.61,23.37 70.61,16.76 v71.63,15.75
N$32  (via drill 1 pad 1.6)
  Bottom 0.305: U$24.RST v69.09,15.75
NFC_IRQ_NFC0  (via drill 0.35)
  Top 0.305: v36.32,41.4 44.55,41.4 U$23.27 | JP7.7 20.57,66.8 22.1,65.28 v22.1,44.7
  Bottom 0.305: v36.32,41.4 36.07,41.4 35.56,40.89 24.64,40.89 22.1,43.43 v22.1,44.7
NFC_IRQ_NFC1  (1 unrouted)
NFC_SEL_NFC0  (via drill 0.35)
  Top 0.305: v36.32,39.88 36.83,40.39 U$23.25 | v19.3,44.96 18.8,45.47 18.8,59.69 16.76,61.72 JP7.5
  Bottom 0.305: v36.32,39.88 36.07,39.88 35.56,39.37 24.89,39.37 v19.3,44.96
NFC_SEL_NFC1  (via drill 0.35)
  Top 0.305: U$23.24 37.59,39.88 v36.58,38.86 | v15.24,38.86 7.62,31.24 JP8.5
  Bottom 0.305: v36.58,38.86 v15.24,38.86
NRST  (via drill 0.35, 0.45)  (1 unrouted)
  Top 0.254: R11.2 49.21,31.68 50.55,33.02 50.55,36.07 v49.28,37.34
  Top 0.305: SWD1.5 30.99,59.44 33.02,57.4 v35.56,57.4 | v39.37,57.4 41.91,57.4 43.18,56.13 v43.18,55.88 | U$23.7 38.1,35.81 39.12,36.83 v41.91,36.83
  Bottom 0.305: v35.56,57.4 v39.37,57.4 | v43.18,55.88 43.18,38.1 v41.91,36.83 | 42.67,37.59 42.93,37.59 43.18,37.34 v49.28,37.34
OSC_IN  (2 unrouted)
OSC_OUT  (2 unrouted)
PRG_RX<
  Top 0.254: U$23.59 33.2,38.94 34.44,38.94 35.2,39.71 35.2,44.36 33.43,46.13 | PWG.1 29.46,50.04 30.48,49.02 30.48,46.74 30.73,46.48 33.09,46.48 33.43,46.13 | 33.43,46.13 33.27,46.3
PRG_TX>
  Top 0.254: U$23.58 34.29,39.37 34.8,39.88 34.8,44.2 33.02,45.97 30.48,45.97 28.96,47.5 PWG.2
SOCK__CS_DP  (1 unrouted)
SOCK__RCLK  (1 unrouted)
SOCK__SEL
  Top 0.305: U$1.P$44 11.87,9.71 12.75,8.82 12.75,6.91 JP6.3
SOCK_A0
  Top 0.305: JP6.10 19.23,8.45 U$3.P$44
SOCK_CLK  (1 unrouted)
SOCK_NCS1
  Top 0.305: JP6.9 18.54,5.84 18.03,6.35 18.03,8.89 18.43,9.29 U$3.P$33
SOCK_NCS2  (1 unrouted)
SOCK_NRD
  Top 0.305: U$3.P$11 16.83,9.96 15.7,8.82 15.7,7.94 16.76,6.87 JP6.7
SOCK_NRST
  Top 0.305: U$3.P$22 17.63,9.25 JP6.8
SOCK_NWR  (1 unrouted)
SOCK_ROTA
  Top 0.305: U$1.P$11 9.47,8.71 JP6.2
SOCK_ROTB
  Top 0.305: JP6.4 11.07,9 U$1.P$33
SOCK_ROTSW
  Top 0.305: JP6.1 9.14,6.87 10.21,7.94 10.21,13.11 U$1.P$22
SOCK_SPI_CLK  (1 unrouted)
SOCK_SPI_MOSI  (1 unrouted)
SPI2_CLK  (via drill 0.4)
  Top 0.305: U$22.CLK 41.91,75.44 47.24,75.44 48.26,74.42 v48.26,68.33 | v48.26,56.39 48.26,49.78 47.5,49.02 44.45,49.02 42.16,46.74 42.16,45.9 U$23.34
  Bottom 0.305: v48.26,68.33 v48.26,56.39
SPI2_MISO  (via drill 0.45)
  Top 0.305: U$23.35 41.61,47.19 44.45,50.04 v44.96,50.04 | v47.24,51.56 47.24,55.12 45.97,56.39 44.2,56.39 42.16,58.42 37.85,58.42 37.34,58.93 37.34,60.96 41.66,65.28 v41.66,66.29
  Bottom 0.305: v44.96,50.04 44.96,50.55 45.47,51.05 46.74,51.05 v47.24,51.56 | v41.66,66.29 41.66,68.58 43.18,70.1 U$22.DAT
SPI5_CLK  (via drill 0.35)
  Top 0.305: U$21.CLK 21.59,75.69 22.61,76.71 31.5,76.71 32.77,75.44 32.77,71.12 36.58,67.31 v52.07,67.31 | v52.07,48.51 v52.07,46.23 | U$23.26 v48.51,40.89
  Bottom 0.305: v52.07,67.31 v52.07,48.51 | v48.51,40.89 49.53,40.89 50.04,41.4 50.04,44.2 v52.07,46.23
SPI5_MISO
  Top 0.305: U$23.45 36.6,65 33.78,67.82 27.69,67.82 24.13,71.38 U$21.DAT
SPI_CLK  (via drill 0.35)  (1 unrouted)
  Top 0.254: 81.79,3.3 80.9,2.16 78.74,2.16 77.98,2.79 77.98,12.19 71.83,18.34 57.47,18.34 52.07,23.74 52.07,37.08 50.78,38.38 U$23.21 39.14,38.38 36.83,36.07 35.43,36.07 30.61,31.24 29.21,31.24 28.96,30.99 v28.96,30.48
  Top 0.305: v16,30.48 14.22,30.48 7.37,23.62 JP8.2 4.06,23.62 2.79,24.89 2.79,45.47 4.83,47.5 8.13,47.5 9.4,48.77 9.4,53.59 8.89,54.1 JP7.2 | 26.92,13.21 34.54,20.83 JP5.2 34.54,22.1 34.04,22.61 32.51,22.61 30.23,24.89 29.46,24.89 28.96,25.4 v28.96,30.48 | U$24.D5 81.79,3.3
  Bottom 0.305: v16,30.48 v28.96,30.48
SPI_MISO  (via drill 0.35)
  Top 0.254: U$23.22 41.29,38.86 38.61,38.86 36.32,36.58 35.31,36.58 32.77,34.04 v29.46,32
  Top 0.305: U$24.D6 79.25,12.19 72.39,19.3 57.66,19.3 52.83,24.13 52.83,37.59 51.56,38.86 44.6,38.86 U$23.22 | v16,32 13.46,32 7.62,26.16 JP8.3 4.32,26.16 3.81,26.67 3.81,45.72 5.08,46.99 8.89,46.99 10.16,48.26 10.16,55.88 9.4,56.64 JP7.3
  Bottom 0.305: v16,32 v29.46,32
SPI_MOSI  (via drill 0.35)  (1 unrouted)
  Top 0.254: U$24.D7 76.71,2.54 77.47,1.65 82.04,1.65 83.06,2.54 83.06,9.65 72.9,20.32 57.8,20.32 53.59,24.52 53.59,37.59 51.82,39.37 U$23.23 38.1,39.37 35.81,37.08 35.18,37.08 32.89,34.8 31.5,34.8 v30.48,33.53
  Top 0.305: 29.46,11.68 35.81,18.03 35.81,19.3 37.08,20.57 JP5.4 37.08,22.35 36.07,23.37 33.02,23.37 30.48,25.91 v30.48,30.48 | v16,33.53 12.45,33.53 7.87,28.7 JP8.4 5.08,28.7 4.57,29.21 4.57,42.67 6.35,44.45 10.16,44.45 10.92,45.21 10.92,58.67 10.41,59.18 JP7.4
  Bottom 0.305: v16,33.53 v30.48,33.53 v30.48,30.48
SWCLK
  Top 0.305: SWD1.2 23.37,44.96 24.38,43.94 25.41,43.94 25.47,43.89 U$23.49
SWDIO
  Top 0.305: U$23.46 36.12,52.53 28.45,60.2 SWD1.4
SWO
  Top 0.254: SWD1.6 33.53,65.53 33.02,66.04 25.4,66.04 24.64,65.28 24.64,46.74 26.97,44.4 33.97,44.4 34.29,44.08 34.29,41.15 34.04,40.89 U$23.55
USB12V
  Top 0.813: D2.C 95.5,49.78
  Top 1.016: SJ5.2 SJ6.2 95.5,58.67 | SJ3.1 95.5,49.78 95.5,52.32 | 95.5,52.32 95.5,58.67 | 95.5,58.67 LM317.3 92.64,58.74 R1.2 | D1.A 95.5,52.32
USBGND  (via drill 0.35)
  Top 1.016: R2.1 93.79,74.17 C4.2
  other vias: 88.9,78.74 91.44,78.74 93.98,78.74 104.14,78.74 96.52,73.15 99.06,73.15 93.98,68.58 90.17,55.88 90.17,53.34 91.44,48.26 88.9,48.26 99.06,48.26 101.6,48.26 106.68,60.96 106.68,66.04 92.71,55.88 92.71,53.34
  pour Bottom: 86.61,80.01 105.92,80.01 109.73,61.21 110.74,45.21 110.74,44.96 86.61,45.21
  pour Top: 86.61,80.01 105.92,80.01 109.73,61.21 110.74,45.21 110.74,44.96 86.61,45.21
USBVBUS
  Top 0.813: C3.1 97.72,68.83 98.81,68.83 100.84,70.87 100.84,73.41 103.38,75.95 SJ12.1 | SJ13.1 SJ9.2 SJ8.2 102.11,60.2 SJ14.1
  Top 1.016: LM317.1 92.71,65.53 93.73,66.55 SJ6.1 SJ5.1 | D1.C 98.55,62.48 99.82,63.75 99.82,65.79 | 99.82,65.79 99.06,66.55 SJ5.1 | SJ5.1 C3.1 | SJ13.1 101.85,65.79 99.82,65.79
V3.3  (via drill 0.35, 0.45)  (6 unrouted)
  Top 0.203: U$23.32 43.83,43.89 43.66,43.72 36.54,43.72 35.42,44.84 35.36,44.84 35.1,45.1 U$23.48
  Top 0.305: U$23.13 41.12,35.28 41.4,35.56 42.93,35.56 43.94,34.54 43.94,32.51 45.4,31.05 C11.1 | U$24.V3.3 64.01,4.83 63.06,5.78 C14.1 61.47,7.62 v59.44,9.65 | U$23.64 32.56,36.37 32,35.81 v32,35.56 30.16,35.56 C1.1 | U$23.1 35.1,33.83 v34.29,33.02 | U$23.32 44.45,44.02 44.45,45.97 45.72,47.24 v46.48,47.24 49.28,47.24 50.04,46.48 50.04,45.21 51.56,43.69 56.13,43.69 SJ10.2 | U$24.V3.3@1 86.87,7.62 86.55,7.94 C15.1 86.55,9.72 v75.44,21.08 | U$24.V3.3@2 74.17,25.72 74.68,25.21 | 74.68,25.21 C16.1 | 45.47,54.62 U1.24 | U1.24 U1.23 | JP6.5 12.19,3.81 8.64,3.81 7.11,5.33 7.11,12.19 8.13,13.21 8.13,18.29 7.11,19.3 JP8.1 | v74.68,23.37 74.68,25.21 | v59.44,23.37 59.44,25.4 | U1.24 45.48,53.58 46.23,52.83 v46.23,50.04 | v22.35,67.56 22.35,68.58 20.32,70.61 20.32,72.9 U$21.VCC
  Top 0.406: C11.1 46.87,31.05 R11.1
  Top 0.61: U$15.VOUT 78.49,36.58 | 74.17,29.97 U$24.V3.3@2 | U$24.V3.3@2 70.1,33.53 70.1,43.18 | 70.1,43.18 77.22,43.18 78.49,41.91 | U$24.V3.3@2 74.17,27.69 71.88,25.4 59.44,25.4 58.42,25.4 v57.15,26.67 | v45.47,26.67 C11.1 | v16.51,29.21 15.75,29.21 7.87,21.08 JP8.1 3.05,21.08 2.03,22.1 2.03,50.8 2.79,51.56 | 70.1,43.18 58.17,43.18 SJ10.2 | 2.79,51.56 JP7.1 | U$22.VCC 38.1,76.97 36.58,78.49 20.57,78.49 19.05,76.96 19.05,76.45 | 19.05,76.45 U$21.VCC | 19.05,76.45 10.41,76.45 7.11,73.15 5.27,73.15 3.81,71.69 3.81,71.37 1.78,69.34 1.78,52.58 2.79,51.56
  Top 0.813: U$15.VOUT 78.49,41.91 U$15.VOUTB C10.1
  Bottom 0.305: JP6.14 22.91,6.91 16.32,6.91 15.25,5.84 JP6.5 | v75.44,21.08 74.68,21.84 v74.68,23.37 | v59.44,9.65 v59.44,23.37 | v46.23,50.04 v46.48,47.24 | SWD1.1 20.83,65.53 22.35,67.06 v22.35,67.56
  Bottom 0.61: v57.15,26.67 v45.47,26.67 35.31,29.21 32,32 v32,35.56 | v16.51,29.21 30.48,29.21 v34.29,33.02
  other vias: 38.1,27.69
V5  (via drill 0.35, 0.45, 1)
  Top 0.152: 45.48,61.45 v45.47,61.47
  Top 0.305: v16.51,74.17 16.51,72.14 16.76,71.88 | v35.56,71.88 v35.56,74.17
  Top 0.61: 80.26,35.81 U$15.VIN 80.79,36.84 79.5,35.56 73.15,35.56 v71.63,34.04 | v80.01,19.3 88.14,27.43 88.14,33.27 90.17,35.31 U$16.VO | JP8.9 9.4,41.4 v10.16,40.64 12.7,43.18 12.7,59.69 11.94,60.45 5.59,60.45 4.57,61.47 4.57,71.37 5.08,71.88 JP7.9 16.76,71.88 v19.05,71.88 | v35.56,71.88 39.12,71.88 39.37,72.14 39.37,75.69 39.88,76.2 55.63,76.2 57.4,74.42 U$13.16 57.4,65.28 56.64,64.52 v45.47,64.52 | JP6.21 JP6.20 | SJ11.2 58.93,33.53 v59.18,33.27 | U$24.V5 62.04,29.46 C5.1 | U1.1 45.48,61.45 | JP6.30 46.48,8.38 50.04,11.94 v72.64,11.94
  Top 0.813: C9.1 85.34,35.81
  Top 1.016: 80.26,35.81 85.34,35.81 U$16.VO
  Bottom 0.61: v80.01,19.3 v72.64,11.94 | 44.96,8.38 JP6.30 42.42,10.92 32,10.92 | v10.16,40.64 10.16,25.4 11.43,24.13 29.97,24.13 31.24,22.86 31.24,19.05 35.05,15.24 32,12.19 32,10.92 | v19.05,71.88 v35.56,71.88 | v45.47,61.47 v45.47,64.52 | 32,10.92 JP6.20 | v71.63,34.04 69.6,32 66.04,32 65.53,31.5 64.01,31.5 | v59.18,33.27 60.96,31.5 64.01,31.5 | 64.01,31.5 U$24.V5
V12
  Top 0.305: 84.07,48.51 84.33,48.51
  Top 0.813: U$13.8 76.96,60.45 84.33,53.09 84.33,48.51 84.33,43.43 85.6,42.16 88.9,42.16 U$16.VI 93.79,40.89 | 93.79,40.89 C2.1 | SJ3.2 95.5,41.15 | J2.3 97.03,37.13 98.04,38.61 95.5,41.15 | 95.5,41.15 95.25,40.89 93.79,40.89
VADJ
  Top 0.813: 88.83,60.89 R1.1 | 89.22,61.21 89.15,61.28 | 90.93,70.87 90.93,71.12
  Top 1.016: R1.1 89.22,61.21 LM317.2 | D2.A 87.88,59.94 88.83,60.89 | 89.15,61.28 89.15,66.55 90.93,68.33 90.93,70.87 91.19,71.12 92.96,71.12 93.98,72.14 C4.1 | 90.93,71.12 90.42,71.63 R2.2
VBUS
  Top 0.813: JP2.4 JP2.2 105.16,73.66 SJ12.2
VBUS_A
  Top 1.016: JP1.4 103.38,48.51 101.09,50.8 SJ14.2
VCAP
  Top 0.305: U$23.30 46.24,42.88 C12.1
VCONN
  Top 1.016: SJ13.2 105.41,67.31 JP2.6
VCONNA
  Top 1.016: SJ9.1 108.2,63.25 108.71,62.48 108.71,46.48 108.2,45.97 JP1.1
VDD
  Top 0.813: JP1.12 103.63,58.93 SJ8.1
VLT_DIR  (via drill 0.35)
  Top 0.305: U$23.36 41.12,47.98 41.15,48.01 v44.45,51.31 | v44.45,61.72 44.75,61.27 44.75,60.25 U1.2
  Bottom 0.305: v44.45,51.31 v44.45,61.72
WIFI_CS
  Top 0.254: U$24.D8 74.17,3.56 76.33,1.14 83.69,1.14 85.6,2.79 85.6,8.89 73.41,21.34 57.91,21.34 54.36,24.89 54.36,40.89 53.37,41.89 U$23.28
  Top 0.305: U$24.D8 74.17,3.81
WIFI_GPIO  (via drill 1 pad 1.6)
  Bottom 0.305: U$24.D1 v97.03,10.16
WIFI_IRQ  (via drill 1 pad 1.6)
  Top 0.305: 44.55,42.42 U$23.29 53.62,42.39 55.12,40.89 55.12,25.15 57.91,22.35 75.44,22.35 88.14,9.65 88.14,2.79 88.9,2.03 99.06,2.03 99.57,2.54 U$24.D0
  Bottom 0.305: U$24.D0 v99.57,10.16

### Text on the board
tPlace: MTR_OUT_B2 | MTR_OUT_B1 | MTR_OUT_A2 | MTR_OUT_A1 | V5 | GND | NFC_IRQ_NFC0 | NFC_SEL_NFC0 | VDD_TARGET | SWCLK | GND | SWDIO | NRST | SWO | SPI_MOSI | SPI_MISO | SPI_CLK | V3.3 | V5 | GND | NFC_IRQ_NFC1 | NFC_SEL_NFC1 | SPI_MOSI | SPI_MISO | SPI_CLK | V3.3